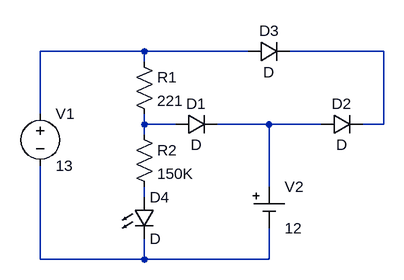
[diagram p0: schematic basic-ups.asc]
basic-ups.asc, the LTspice schematic file:
Version 4
SHEET 1 880 680
WIRE 80 32 -80 32
WIRE 240 32 80 32
WIRE 448 32 304 32
WIRE 80 48 80 32
WIRE -80 128 -80 32
WIRE 80 144 80 128
WIRE 128 144 80 144
WIRE 272 144 192 144
WIRE 352 144 272 144
WIRE 448 144 448 32
WIRE 448 144 416 144
WIRE 80 160 80 144
WIRE 272 240 272 144
WIRE 80 256 80 240
WIRE -80 352 -80 208
WIRE 80 352 80 320
WIRE 80 352 -80 352
WIRE 272 352 272 304
WIRE 272 352 80 352
SYMBOL diode 128 160 R270
WINDOW 0 32 32 VTop 2
WINDOW 3 0 32 VBottom 2
SYMATTR InstName D1
SYMBOL diode 352 160 R270
WINDOW 0 32 32 VTop 2
WINDOW 3 0 32 VBottom 2
SYMATTR InstName D2
SYMBOL diode 240 48 R270
WINDOW 0 32 32 VTop 2
WINDOW 3 0 32 VBottom 2
SYMATTR InstName D3
SYMBOL voltage -80 112 R0
WINDOW 123 0 0 Left 0
WINDOW 39 0 0 Left 0
SYMATTR InstName V1
SYMATTR Value 13
SYMBOL res 64 32 R0
SYMATTR InstName R1
SYMATTR Value 221
SYMATTR SpiceLine tol=1 pwr=0.1
SYMBOL LED 64 256 R0
SYMATTR InstName D4
SYMBOL res 64 144 R0
SYMATTR InstName R2
SYMATTR Value 150K
SYMATTR SpiceLine tol=1 pwr=0.1
SYMBOL Misc\\cell 272 240 R0
WINDOW 123 0 0 Left 0
WINDOW 39 0 0 Left 0
SYMATTR InstName V2
SYMATTR Value 12

The netlist it stands for:
* basic-ups.asc
D1 N003 N004 D
D2 N004 N002 D
D3 N001 N002 D
V1 N001 N006 13
R1 N001 N003 221 tol=1 pwr=0.1
D4 N005 N006 D
R2 N003 N005 150K tol=1 pwr=0.1
V2 N004 N006 12
.model D D
.lib standard.dio
.backanno
.end